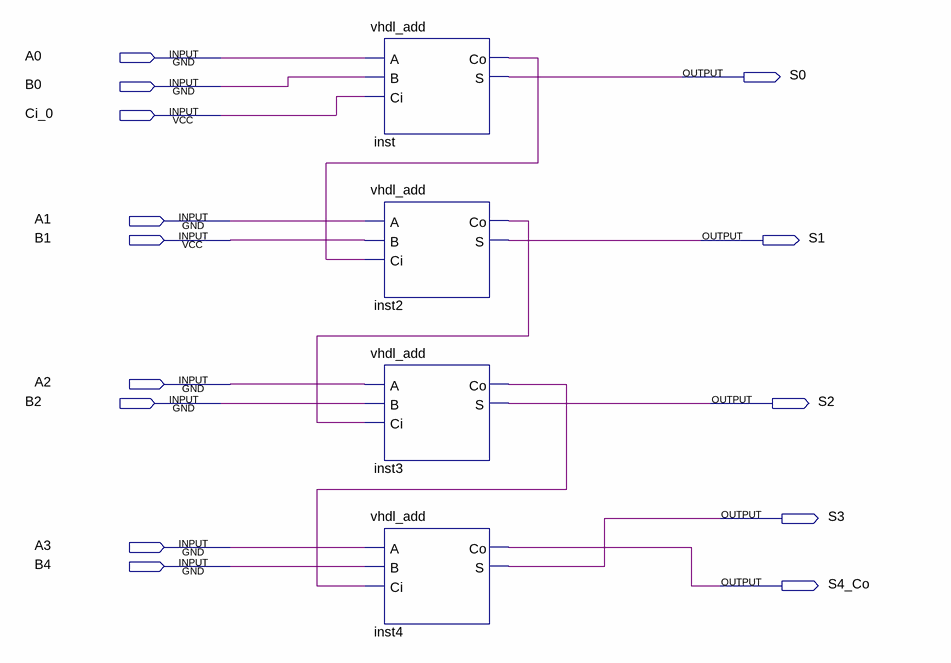
[diagram p0: schematic sheet]
// Quartus schematic 2023_09_17_aula_03_.bdf as structural Verilog: 4 symbols, 14 pins
module \2023_09_17_aula_03_  (
  input  A0,
  input  B0,
  input  Ci_0,
  input  A1,
  input  B1,
  input  A2,
  input  B2,
  input  A3,
  input  B4,
  output S0,
  output S1,
  output S2,
  output S3,
  output S4_Co
);

  wire inst2_co, inst3_co, inst_co;

  vhdl_add inst (.A(A0), .B(B0), .Ci(Ci_0), .Co(inst_co), .S(S0));
  vhdl_add inst2 (.A(A1), .B(B1), .Ci(inst_co), .Co(inst2_co), .S(S1));
  vhdl_add inst3 (.A(A2), .B(B2), .Ci(inst2_co), .Co(inst3_co), .S(S2));
  vhdl_add inst4 (.A(A3), .B(B4), .Ci(inst3_co), .Co(S4_Co), .S(S3));
endmodule
